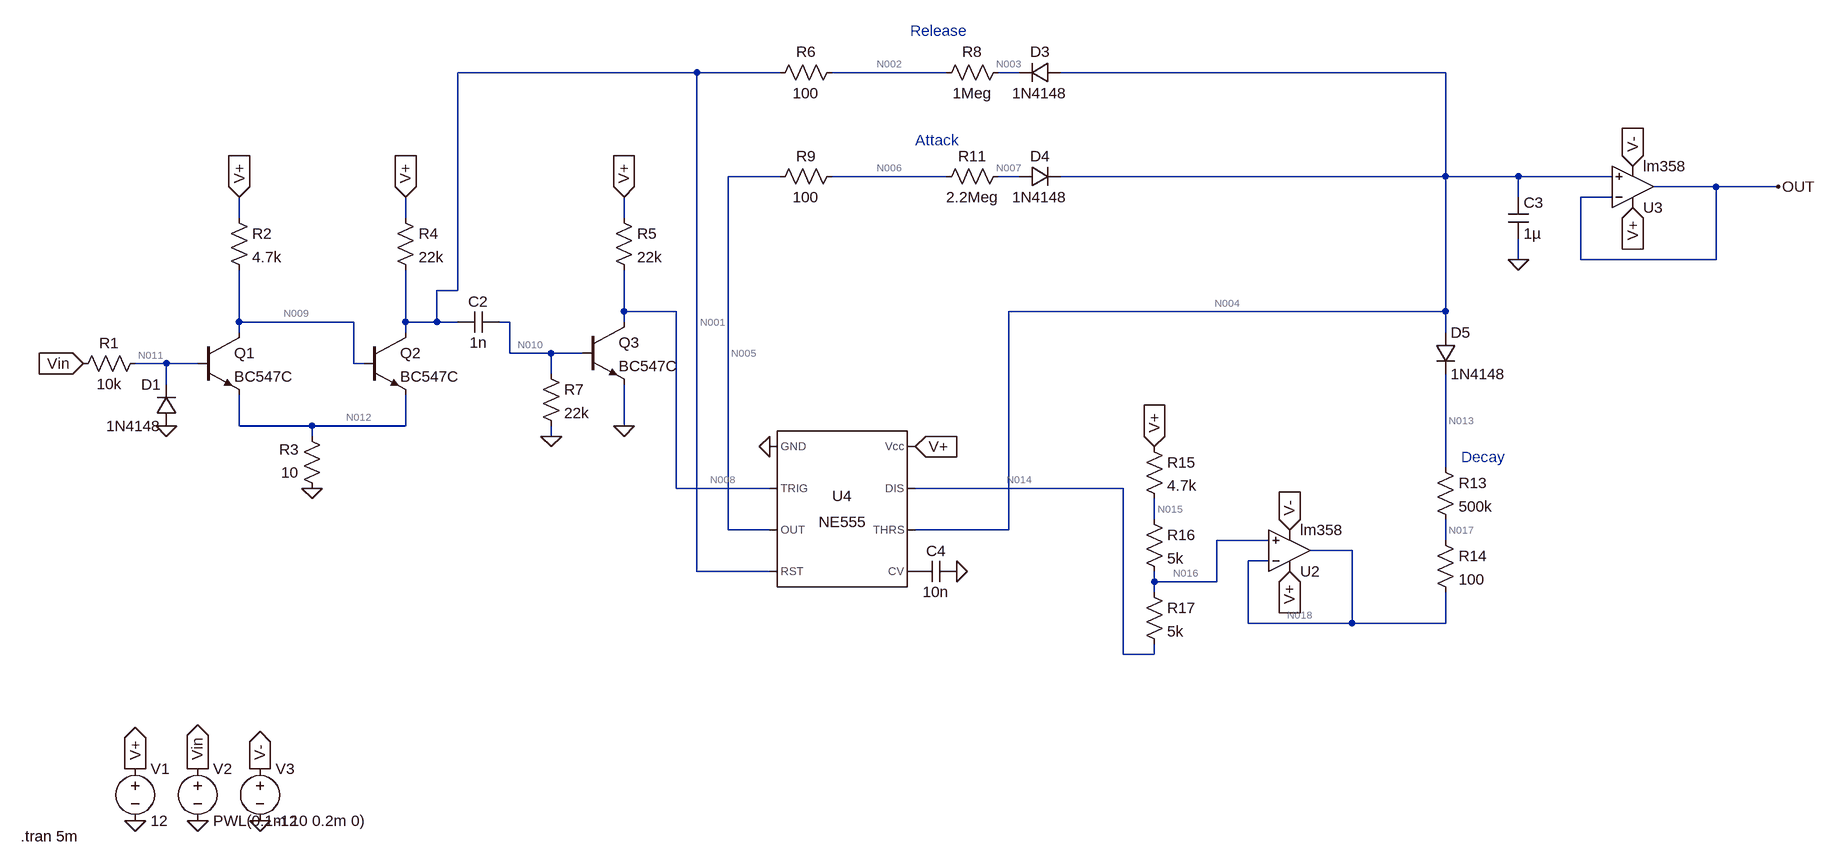
[diagram p0: schematic EG con NE555_V2.asc]
* EG con NE555_V2.asc
V1 V+ 0 12
V2 Vin 0 PWL(0.1m 10 0.2m 0)
V3 V- 0 -12
R1 N011 Vin 10k
D1 0 N011 1N4148
Q1 N009 N011 N012 0 BC547C
R2 V+ N009 4.7k
Q2 N001 N009 N012 0 BC547C
R4 V+ N001 22k
C2 N010 N001 1n
Q3 N008 N010 0 0 BC547C
R5 V+ N008 22k
R6 N002 N001 100
R8 N003 N002 1Meg
D3 N004 N003 1N4148
R9 N006 N005 100
R11 N007 N006 2.2Meg
D4 N007 N004 1N4148
D5 N004 N013 1N4148
R13 N013 N017 500k
R14 N017 N018 100
R15 V+ N015 4.7k
R16 N015 N016 5k
R17 N016 N014 5k
* U2: lm358 (symbol lm358 not available, pins judged from their places): In+=N016 In-=N018 V+=V+ V-=V- OUT=N018
* U3: lm358 (symbol lm358 not available, pins judged from their places): In+=N004 In-=OUT V+=V+ V-=V- OUT=OUT
C3 N004 0 1µ
XU4 0 N008 N005 N001 P001 N004 N014 V+ NE555  ; pins GND TRIG OUT RST CV THRS DIS Vcc
C4 0 P001 10n
R7 N010 0 22k
R3 0 N012 10
.model D D
.lib standard.dio
.model NPN NPN
.model PNP PNP
.lib standard.bjt
* Release
* Attack
* Decay
.tran 5m
.lib NE555.sub
.backanno
.end

* Results of the author's LTspice run, read from the files saved beside the schematic
* Operating Point, zero values left out:
*   V(v+) = 12 V
*   V(vin) = 10 V
*   V(v-) = -12 V
*   V(n011) = 723.8 mV
*   V(n009) = 42.23 mV
*   V(n012) = 34.72 mV
*   V(n001) = 11.73 V
*   V(n010) = 264.6 nV
*   V(n008) = 12 V
*   V(n002) = 11.73 V
*   V(n003) = 11.73 V
*   V(n004) = 4.131 V
*   V(n006) = 72.27 µV
*   V(n005) = 72.01 µV
*   V(n007) = 5.625 mV
*   V(n013) = 4.087 V
*   V(n017) = 4.085 V
*   V(n018) = 4.085 V
*   V(n015) = 8.165 V
*   V(n016) = 4.085 V
*   V(n014) = 4.896 mV
*   V(out) = 4.131 V
*   V(p001) = 8 V
*   Ic(Q3) = 12.09 pA
*   Ib(Q3) = -12.03 pA
*   Ic(Q2) = 11.79 pA
*   Ib(Q2) = -11.71 pA
*   Ic(Q1) = 2.544 mA
*   Ib(Q1) = 927.6 µA
*   Ie(Q1) = -3.472 mA
*   I(C3) = 854.2 pA
*   I(D5) = 4.142 nA
*   I(D4) = -2.524 nA
*   I(D3) = -2.528 nA
*   I(D1) = -2.521 nA
*   I(R3) = -3.472 mA
*   I(R7) = 12.03 pA
*   I(R17) = 816 µA
*   I(R16) = 816 µA
*   I(R15) = 816 µA
*   I(R14) = 4.142 nA
*   I(R13) = 4.142 nA
*   I(R11) = 2.524 nA
*   I(R9) = 2.524 nA
*   I(R8) = -2.528 nA
*   I(R6) = -2.528 nA
*   I(R5) = 12.01 nA
*   I(R4) = 12.2 µA
*   I(R2) = 2.544 mA
*   I(R1) = -927.6 µA
*   I(V3) = 495.1 µA
*   I(V2) = -927.6 µA
*   I(V1) = -7.735 mA
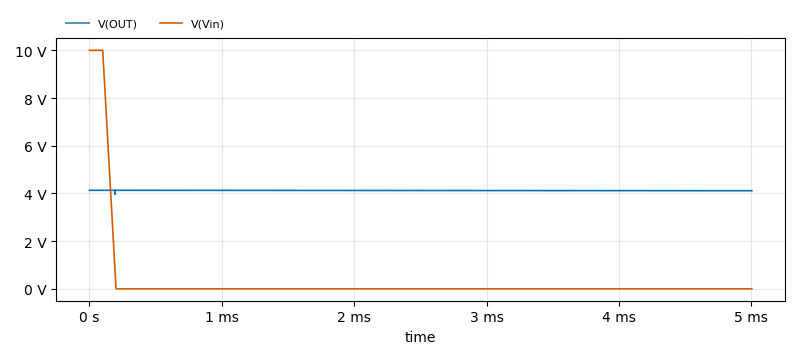
[diagram p1: Transient Analysis of EG con NE555_V2.asc, plotted from the saved traces]
* Transient Analysis, 1 run:
*   V(OUT): min 3.967 V, max 4.136 V, average 4.123 V, rms 4.123 V, last 4.113 V
*   V(Vin): min 0 V, max 10 V, average 299.8 mV, rms 1.635 V, last 0 V